# EAGLE schematic XMICRO BP8 (EAGLE 6.3)
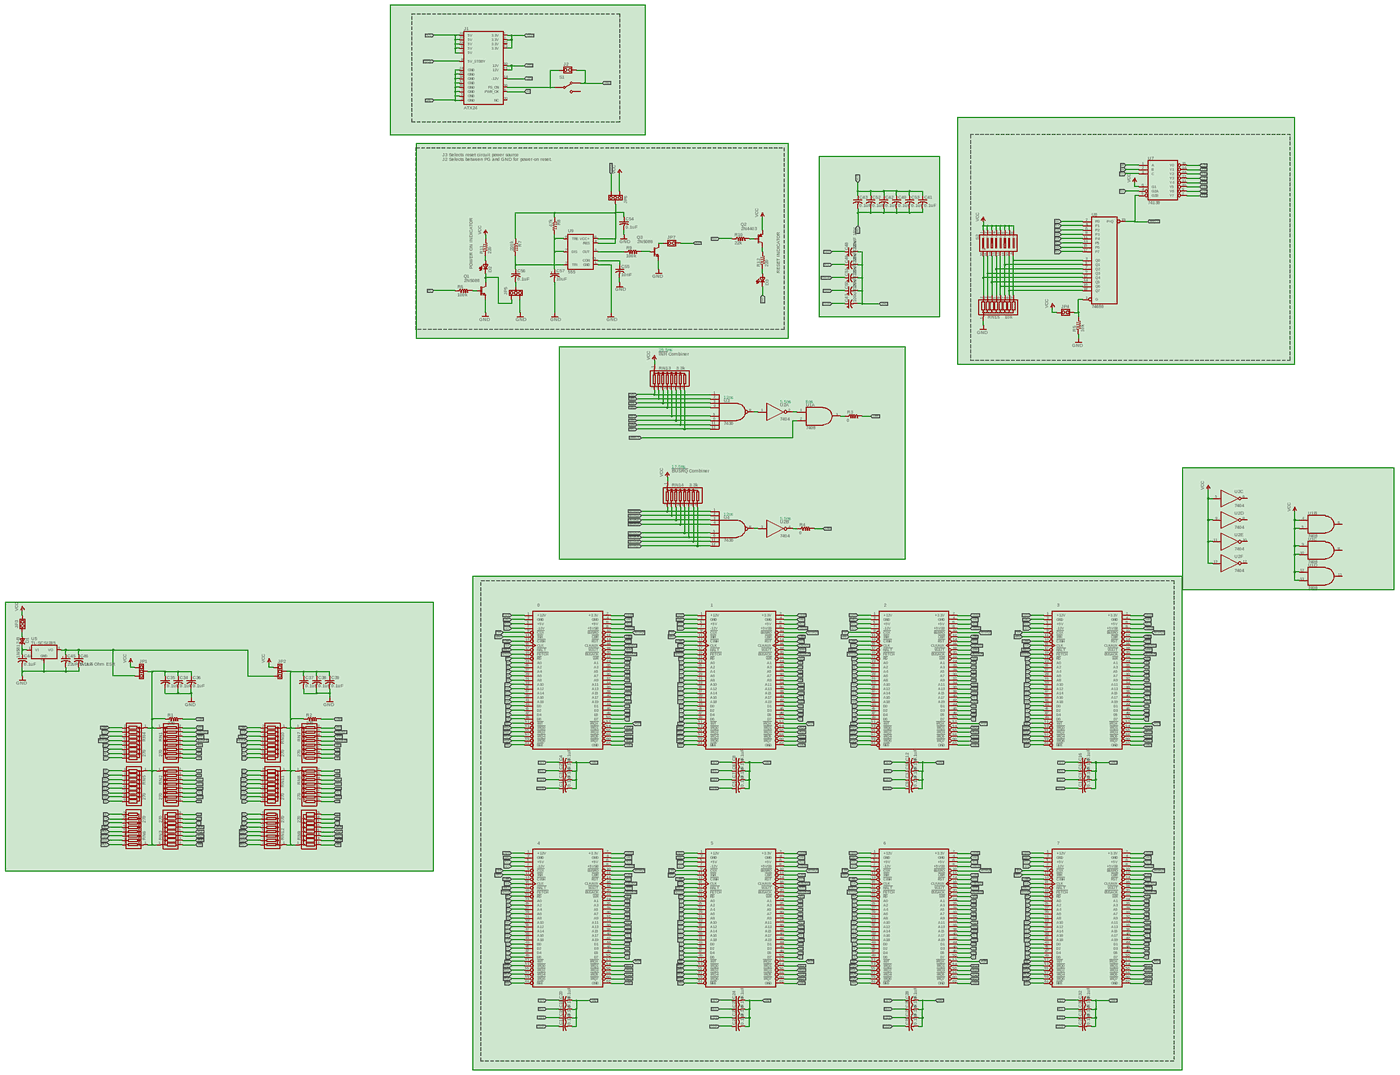
[diagram p0: schematic, sheet 1, overview]
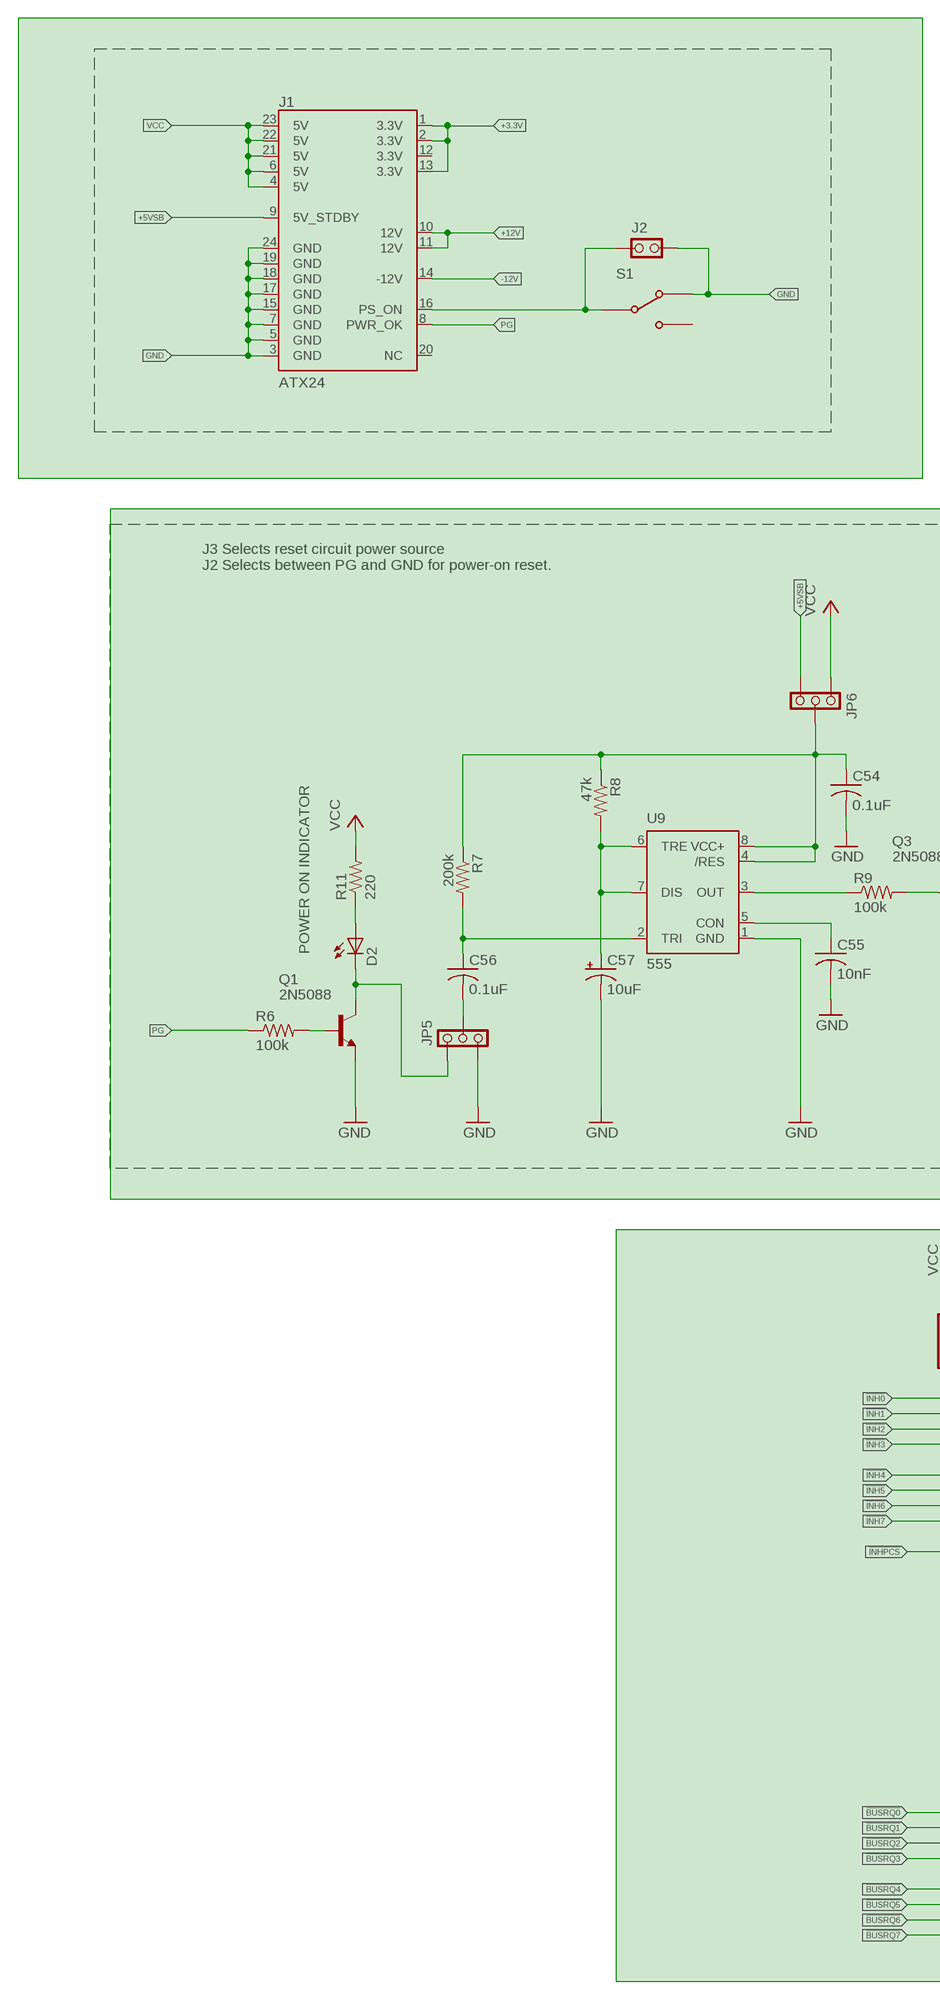
[diagram p1: schematic, sheet 1, part 1 of 4]
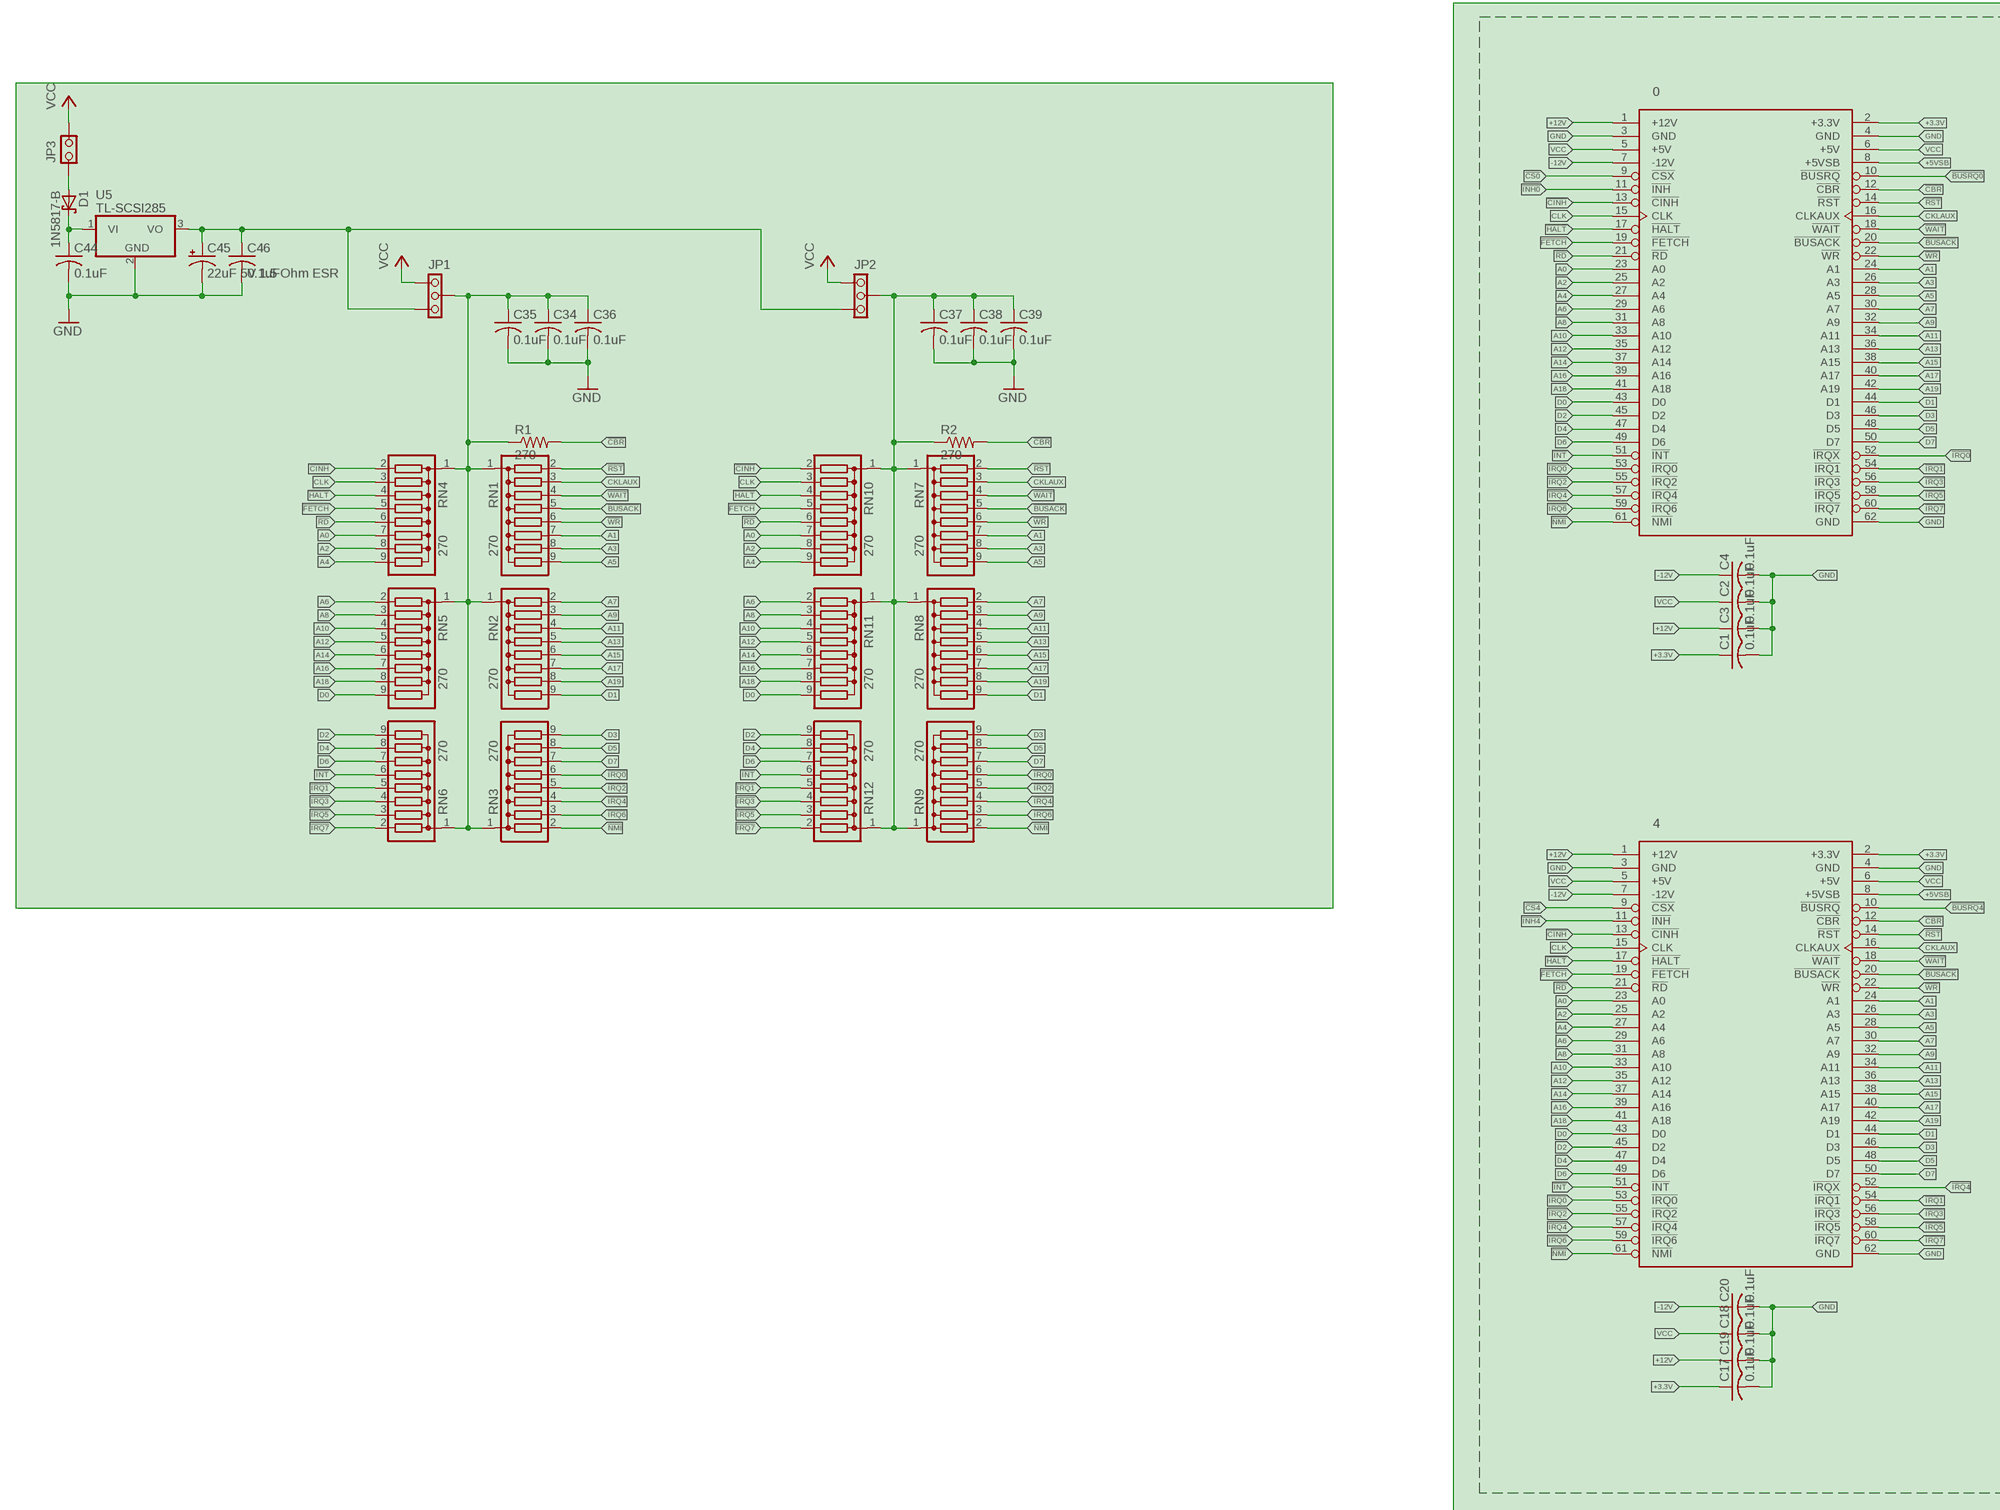
[diagram p2: schematic, sheet 1, part 2 of 4]
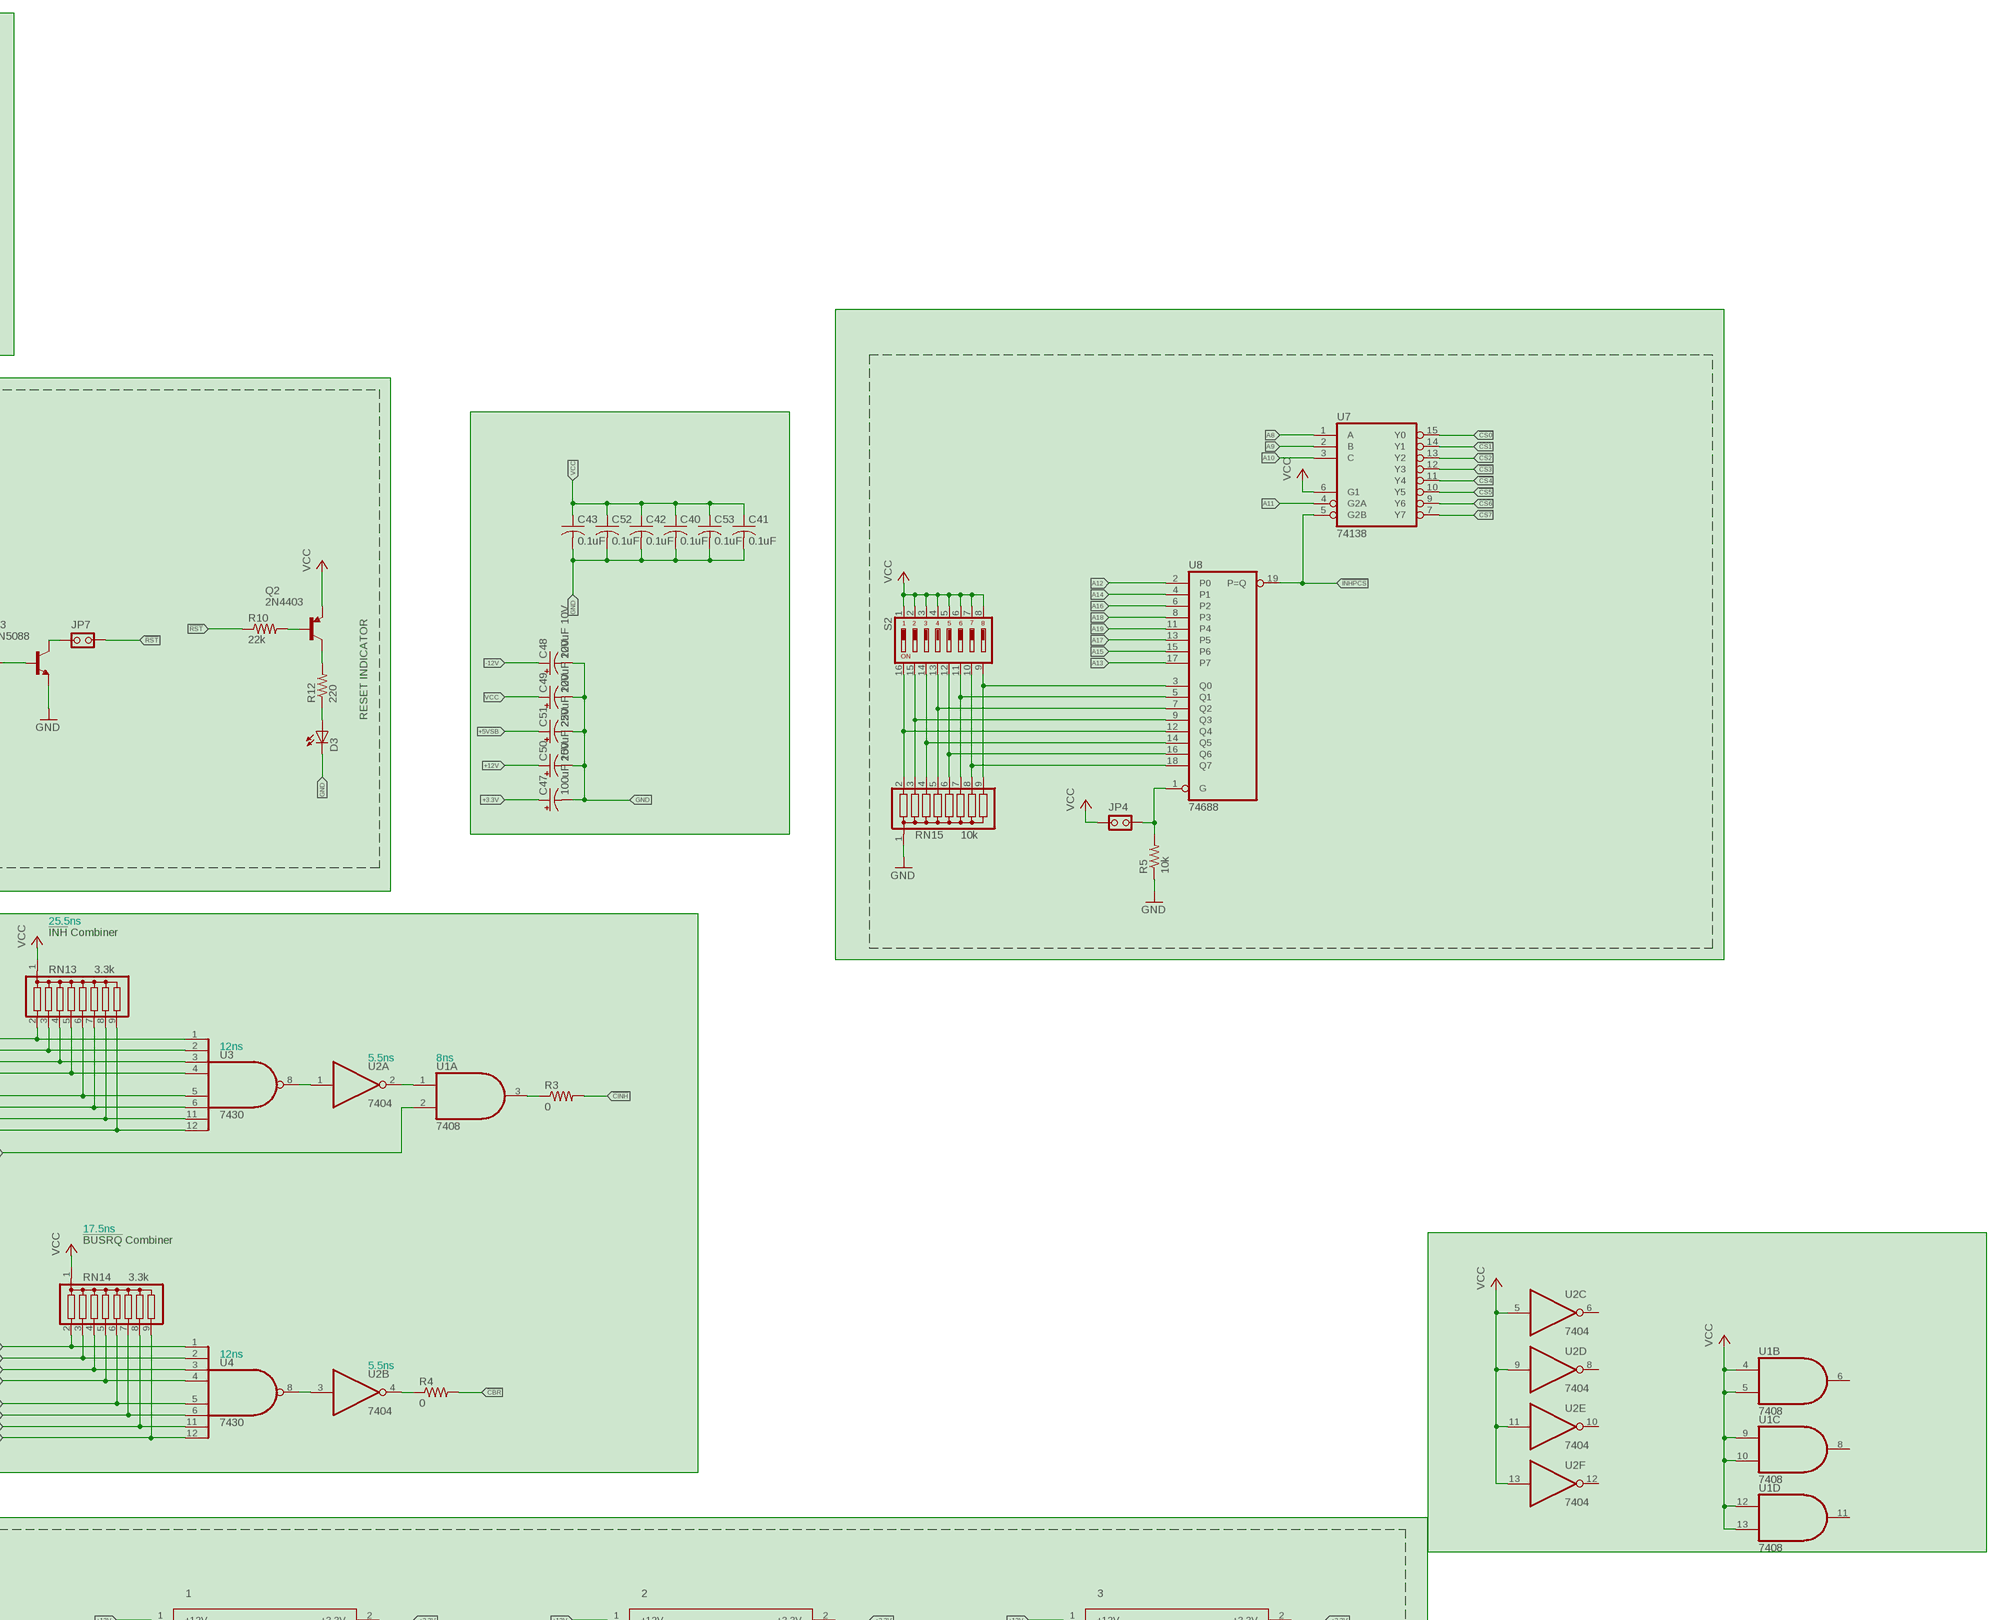
[diagram p3: schematic, sheet 1, part 3 of 4]
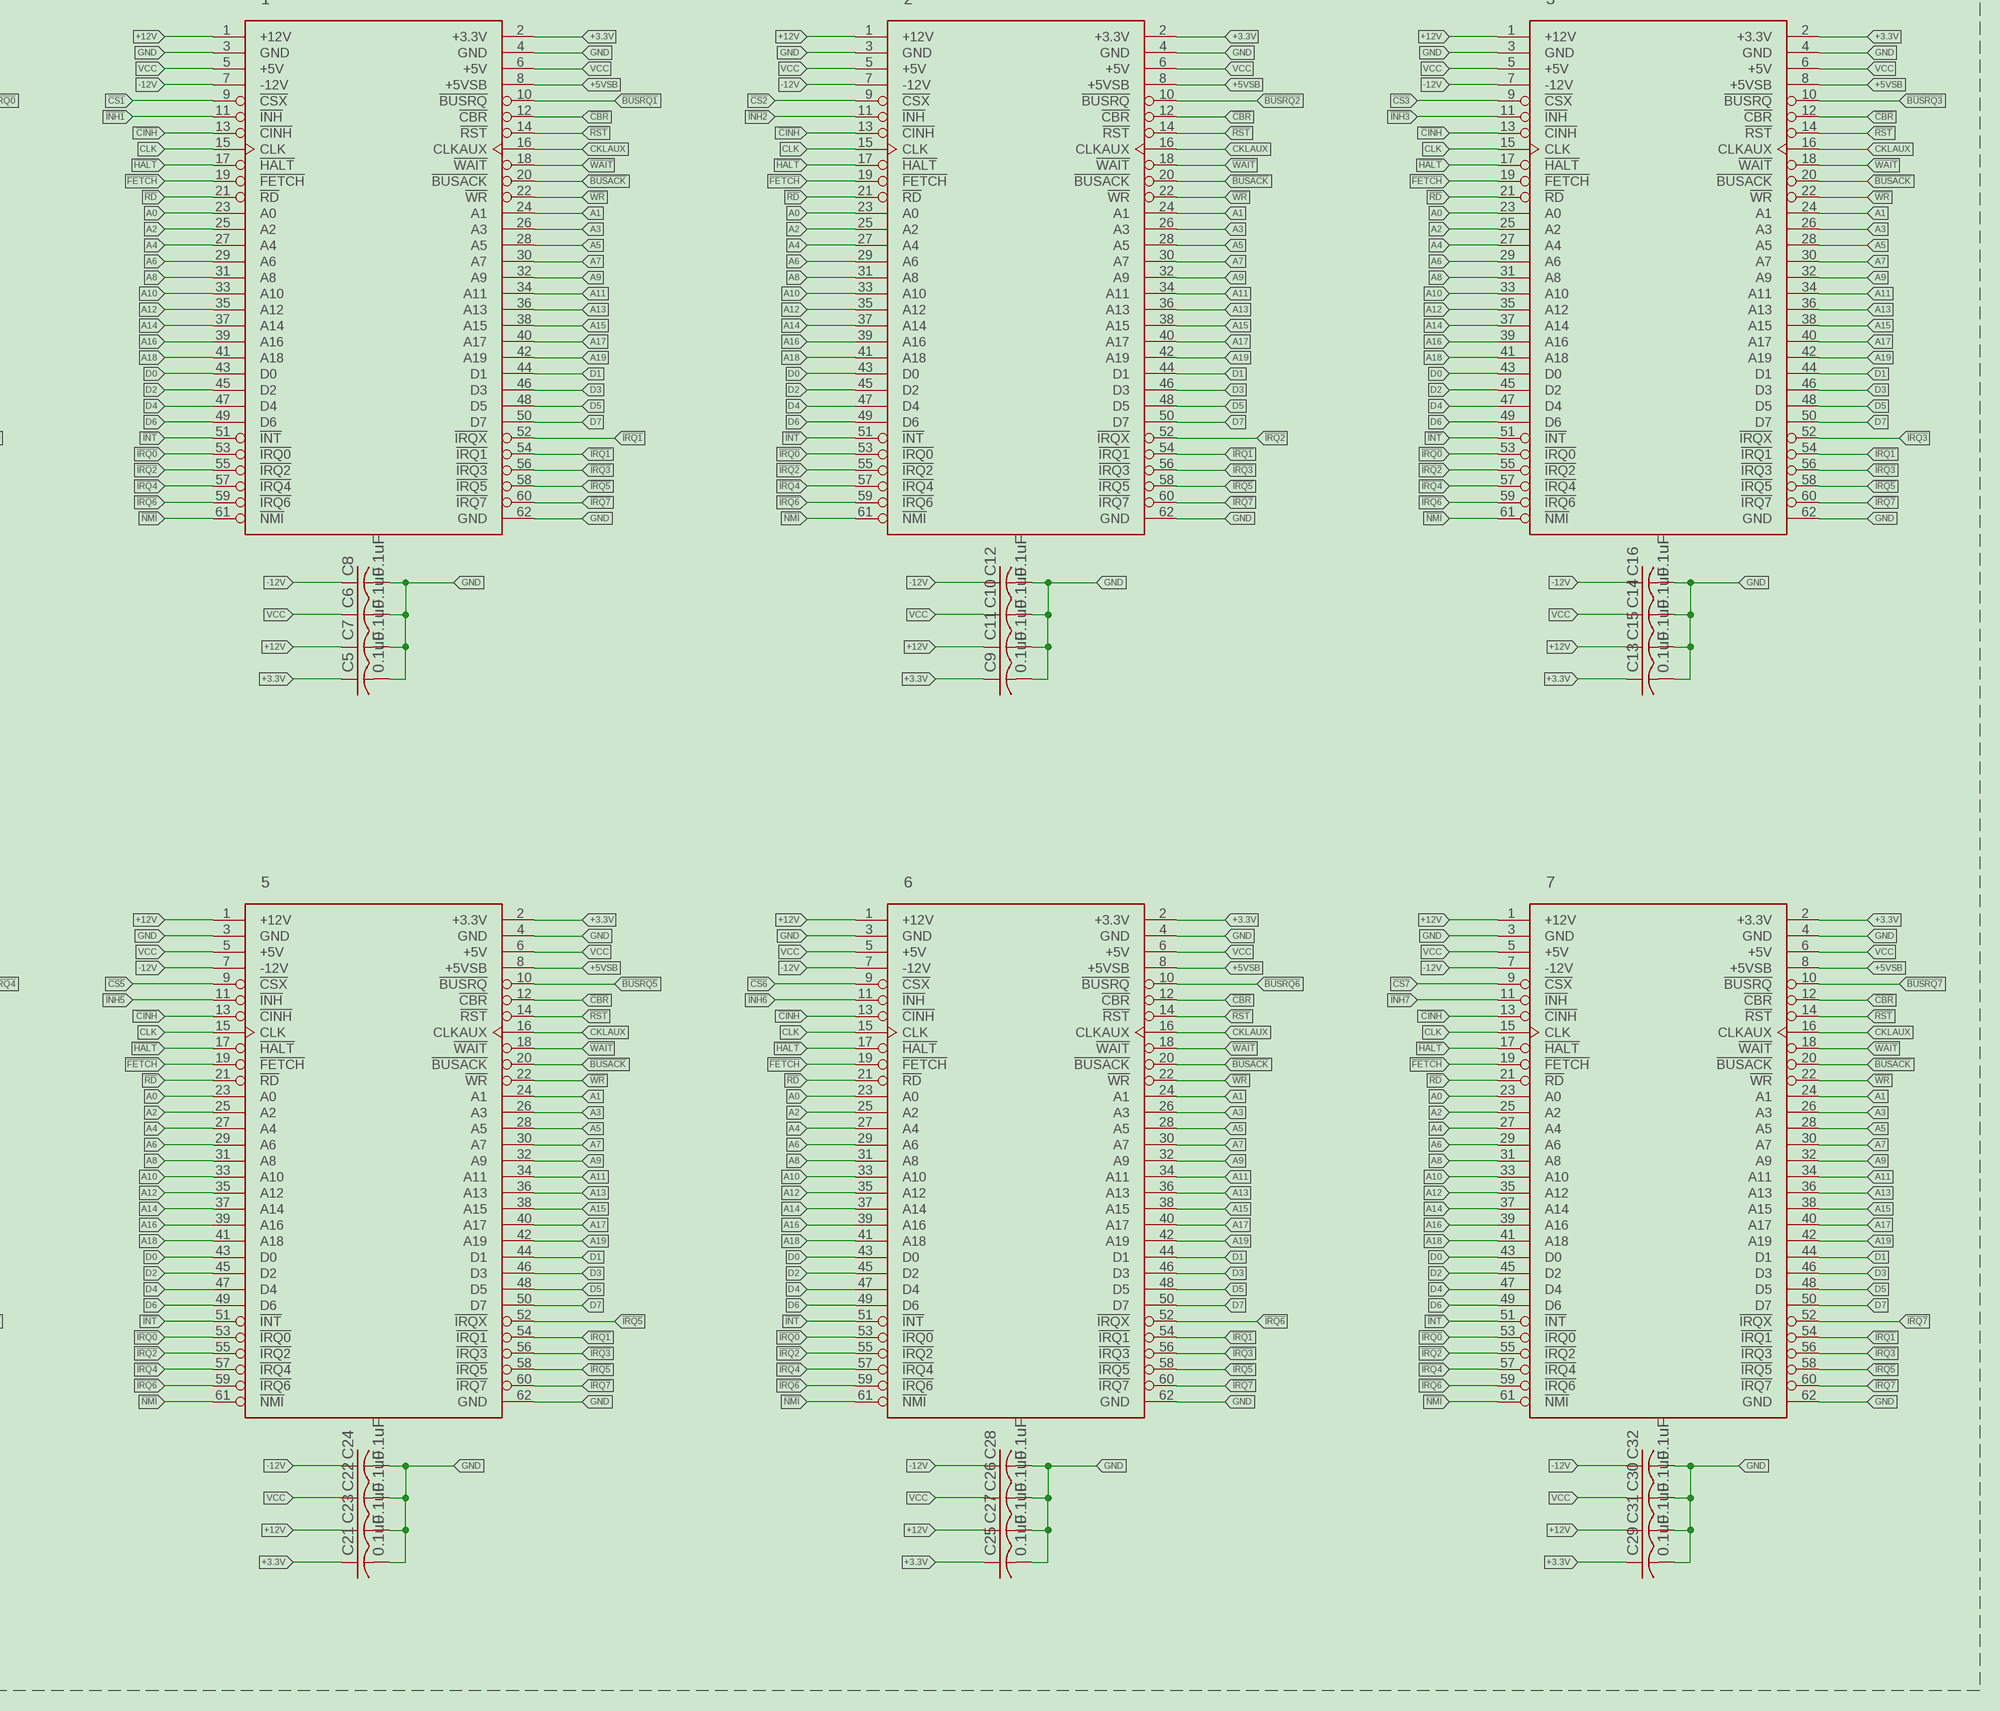
[diagram p4: schematic, sheet 1, part 4 of 4]

## Parts
0  XMICRO-BUS-PHYSICAL-EDGE62F  [EDGE62F]
1  XMICRO-BUS-PHYSICAL-EDGE62F  [EDGE62F]
2  XMICRO-BUS-PHYSICAL-EDGE62F  [EDGE62F]
3  XMICRO-BUS-PHYSICAL-EDGE62F  [EDGE62F]
4  XMICRO-BUS-PHYSICAL-EDGE62F  [EDGE62F]
5  XMICRO-BUS-PHYSICAL-EDGE62F  [EDGE62F]
6  XMICRO-BUS-PHYSICAL-EDGE62F  [EDGE62F]
7  XMICRO-BUS-PHYSICAL-EDGE62F  [EDGE62F]
C1  0.1uF  C-US025-024X044  [C025-024X044]
C2  0.1uF  C-US025-024X044  [C025-024X044]
C3  0.1uF  C-US025-024X044  [C025-024X044]
C4  0.1uF  C-US050-024X044  [C050-024X044]
C5  0.1uF  C-US025-024X044  [C025-024X044]
C6  0.1uF  C-US025-024X044  [C025-024X044]
C7  0.1uF  C-US025-024X044  [C025-024X044]
C8  0.1uF  C-US050-024X044  [C050-024X044]
C9  0.1uF  C-US025-024X044  [C025-024X044]
C10  0.1uF  C-US025-024X044  [C025-024X044]
C11  0.1uF  C-US025-024X044  [C025-024X044]
C12  0.1uF  C-US050-024X044  [C050-024X044]
C13  0.1uF  C-US025-024X044  [C025-024X044]
C14  0.1uF  C-US025-024X044  [C025-024X044]
C15  0.1uF  C-US025-024X044  [C025-024X044]
C16  0.1uF  C-US050-024X044  [C050-024X044]
C17  0.1uF  C-US025-024X044  [C025-024X044]
C18  0.1uF  C-US025-024X044  [C025-024X044]
C19  0.1uF  C-US025-024X044  [C025-024X044]
C20  0.1uF  C-US050-024X044  [C050-024X044]
C21  0.1uF  C-US025-024X044  [C025-024X044]
C22  0.1uF  C-US025-024X044  [C025-024X044]
C23  0.1uF  C-US025-024X044  [C025-024X044]
C24  0.1uF  C-US050-024X044  [C050-024X044]
C25  0.1uF  C-US025-024X044  [C025-024X044]
C26  0.1uF  C-US025-024X044  [C025-024X044]
C27  0.1uF  C-US025-024X044  [C025-024X044]
C28  0.1uF  C-US050-024X044  [C050-024X044]
C29  0.1uF  C-US025-024X044  [C025-024X044]
C30  0.1uF  C-US025-024X044  [C025-024X044]
C31  0.1uF  C-US025-024X044  [C025-024X044]
C32  0.1uF  C-US025-024X044  [C025-024X044]
C34  0.1uF  C-US025-024X044  [C025-024X044]
C35  0.1uF  C-US025-024X044  [C025-024X044]
C36  0.1uF  C-US025-024X044  [C025-024X044]
C37  0.1uF  C-US025-024X044  [C025-024X044]
C38  0.1uF  C-US025-024X044  [C025-024X044]
C39  0.1uF  C-US025-024X044  [C025-024X044]
C40  0.1uF  C-US025-024X044  [C025-024X044]
C41  0.1uF  C-US025-024X044  [C025-024X044]
C42  0.1uF  C-US025-024X044  [C025-024X044]
C43  0.1uF  C-US025-024X044  [C025-024X044]
C44  0.1uF  C-US025-024X044  [C025-024X044]
C45  22uF 5V 1.5 Ohm ESR  CPOL-USE2.5-7  [E2,5-7]
C46  0.1uF  C-US050-024X044  [C050-024X044]
C47  100uF 25V  CPOL-US-10-5  [C-10-5]
C48  220uF 10V  CPOL-US-10-5  [C-10-5]
C49  220uF 10V  CPOL-US-10-5  [C-10-5]
C50  100uF 25V  CPOL-US-10-5  [C-10-5]
C51  220uF 10V  CPOL-US-10-5  [C-10-5]
C52  0.1uF  C-US025-024X044  [C025-024X044]
C53  0.1uF  C-US025-024X044  [C025-024X044]
C54  0.1uF  C-US025-024X044  [C025-024X044]
C55  10nF  C-US025-024X044  [C025-024X044]
C56  0.1uF  C-US025-024X044  [C025-024X044]
C57  10uF  CPOL-USE2.5-7  [E2,5-7]
D1  1N5817-B  [DO41-7.6]
D2  LED5MM  [LED5MM]
D3  LED5MM  [LED5MM]
J1  ATX24  [ATX24]
J2  PINHD-1X2THRU  [1X02]
JP1  PINHD1X3THRU  [1X03]
JP2  PINHD1X3THRU  [1X03]
JP3  PINHD-1X2THRU  [1X02]
JP4  PINHD-1X2THRU  [1X02]
JP5  PINHD1X3THRU  [1X03]
JP6  PINHD1X3THRU  [1X03]
JP7  PINHD-1X2THRU  [1X02]
Q1  2N5088  TRANSISTOR-NPN-2N5088  [TO92]
Q2  2N4403  TRANSISTOR-PNP-2N4403  [TO92]
Q3  2N5088  TRANSISTOR-NPN-2N5088  [TO92]
R1  270  R-US_0207/10  [0207/10]
R2  270  R-US_0207/10  [0207/10]
R3  0  R-US_0207/10  [0207/10]
R4  0  R-US_0207/10  [0207/10]
R5  10k  R-US_0207/10  [0207/10]
R6  100k  R-US_0207/10  [0207/10]
R7  200k  R-US_0207/10  [0207/10]
R8  47k  R-US_0207/10  [0207/10]
R9  100k  R-US_0207/10  [0207/10]
R10  22k  R-US_0207/10  [0207/10]
R11  220  R-US_0207/10  [0207/10]
R12  220  R-US_0207/10  [0207/10]
RN1  270  G08R  [SIL9]
RN2  270  G08R  [SIL9]
RN3  270  G08R  [SIL9]
RN4  270  G08R  [SIL9]
RN5  270  G08R  [SIL9]
RN6  270  G08R  [SIL9]
RN7  270  G08R  [SIL9]
RN8  270  G08R  [SIL9]
RN9  270  G08R  [SIL9]
RN10  270  G08R  [SIL9]
RN11  270  G08R  [SIL9]
RN12  270  G08R  [SIL9]
RN13  3.3k  G08R  [SIL9]
RN14  3.3k  G08R  [SIL9]
RN15  10k  G08R  [SIL9]
S1  SPDTT411013  [T411013]
S2  SW-DIP08  [SW-DIP8]
U1  7408  74LS08N  [DIL14]
U2  7404  74LS04N  [DIL14]
U3  7430  74LS30N  [DIL14]
U4  7430  74LS30N  [DIL14]
U5  TL-SCSI285  TL-SCSI285-TO220H  [TO220H]
U7  74138  74LS138N  [DIL16]
U8  74688  74LS688N  [DIL20]
U9  555  NE555  [DIL-08]

## Nets
!BUSACK: 0.20(!BUSACK) 1.20(!BUSACK) 2.20(!BUSACK) 3.20(!BUSACK) 4.20(!BUSACK) 5.20(!BUSACK) 6.20(!BUSACK) 7.20(!BUSACK) RN1.5 RN7.5
!BUSRQ0: 0.10(!BUSRQ) RN14.2 U4.1(I0)
!BUSRQ1: 1.10(!BUSRQ) RN14.3 U4.2(I1)
!BUSRQ2: 2.10(!BUSRQ) RN14.4 U4.3(I2)
!BUSRQ3: 3.10(!BUSRQ) RN14.5 U4.4(I3)
!BUSRQ4: 4.10(!BUSRQ) RN14.6 U4.5(I4)
!BUSRQ5: 5.10(!BUSRQ) RN14.7 U4.6(I5)
!BUSRQ6: 6.10(!BUSRQ) RN14.8 U4.11(I6)
!BUSRQ7: 7.10(!BUSRQ) RN14.9 U4.12(I7)
!CBR: 0.12(!CBR) 1.12(!CBR) 2.12(!CBR) 3.12(!CBR) 4.12(!CBR) 5.12(!CBR) 6.12(!CBR) 7.12(!CBR) R1.2 R2.2 R4.2
!CINH: 0.13(!CINH) 1.13(!CINH) 2.13(!CINH) 3.13(!CINH) 4.13(!CINH) 5.13(!CINH) 6.13(!CINH) 7.13(!CINH) R3.2 RN4.2 RN10.2
!CS0: 0.9(!CSX) U7.15(Y0)
!CS1: 1.9(!CSX) U7.14(Y1)
!CS2: 2.9(!CSX) U7.13(Y2)
!CS3: 3.9(!CSX) U7.12(Y3)
!CS4: 4.9(!CSX) U7.11(Y4)
!CS5: 5.9(!CSX) U7.10(Y5)
!CS6: 6.9(!CSX) U7.9(Y6)
!CS7: 7.9(!CSX) U7.7(Y7)
!FETCH: 0.19(!FETCH) 1.19(!FETCH) 2.19(!FETCH) 3.19(!FETCH) 4.19(!FETCH) 5.19(!FETCH) 6.19(!FETCH) 7.19(!FETCH) RN4.5 RN10.5
!HALT: 0.17(!HALT) 1.17(!HALT) 2.17(!HALT) 3.17(!HALT) 4.17(!HALT) 5.17(!HALT) 6.17(!HALT) 7.17(!HALT) RN4.4 RN10.4
!INH0: 0.11(!INH) RN13.2 U3.1(I0)
!INH1: 1.11(!INH) RN13.3 U3.2(I1)
!INH2: 2.11(!INH) RN13.4 U3.3(I2)
!INH3: 3.11(!INH) RN13.5 U3.4(I3)
!INH4: 4.11(!INH) RN13.6 U3.5(I4)
!INH5: 5.11(!INH) RN13.7 U3.6(I5)
!INH6: 6.11(!INH) RN13.8 U3.11(I6)
!INH7: 7.11(!INH) RN13.9 U3.12(I7)
!INHPCS: U1.2(A:I1) U7.5(G2B) U8.19(P=Q)
!INT: 0.51(!INT) 1.51(!INT) 2.51(!INT) 3.51(!INT) 4.51(!INT) 5.51(!INT) 6.51(!INT) 7.51(!INT) RN6.6 RN12.6
!IRQ0: 0.52(!IRQX) 0.53(!IRQ0) 1.53(!IRQ0) 2.53(!IRQ0) 3.53(!IRQ0) 4.53(!IRQ0) 5.53(!IRQ0) 6.53(!IRQ0) 7.53(!IRQ0) RN3.6 RN9.6
!IRQ1: 0.54(!IRQ1) 1.52(!IRQX) 1.54(!IRQ1) 2.54(!IRQ1) 3.54(!IRQ1) 4.54(!IRQ1) 5.54(!IRQ1) 6.54(!IRQ1) 7.54(!IRQ1) RN6.5 RN12.5
!IRQ2: 0.55(!IRQ2) 1.55(!IRQ2) 2.52(!IRQX) 2.55(!IRQ2) 3.55(!IRQ2) 4.55(!IRQ2) 5.55(!IRQ2) 6.55(!IRQ2) 7.55(!IRQ2) RN3.5 RN9.5
!IRQ3: 0.56(!IRQ3) 1.56(!IRQ3) 2.56(!IRQ3) 3.52(!IRQX) 3.56(!IRQ3) 4.56(!IRQ3) 5.56(!IRQ3) 6.56(!IRQ3) 7.56(!IRQ3) RN6.4 RN12.4
!IRQ4: 0.57(!IRQ4) 1.57(!IRQ4) 2.57(!IRQ4) 3.57(!IRQ4) 4.52(!IRQX) 4.57(!IRQ4) 5.57(!IRQ4) 6.57(!IRQ4) 7.57(!IRQ4) RN3.4 RN9.4
!IRQ5: 0.58(!IRQ5) 1.58(!IRQ5) 2.58(!IRQ5) 3.58(!IRQ5) 4.58(!IRQ5) 5.52(!IRQX) 5.58(!IRQ5) 6.58(!IRQ5) 7.58(!IRQ5) RN6.3 RN12.3
!IRQ6: 0.59(!IRQ6) 1.59(!IRQ6) 2.59(!IRQ6) 3.59(!IRQ6) 4.59(!IRQ6) 5.59(!IRQ6) 6.52(!IRQX) 6.59(!IRQ6) 7.59(!IRQ6) RN3.3 RN9.3
!IRQ7: 0.60(!IRQ7) 1.60(!IRQ7) 2.60(!IRQ7) 3.60(!IRQ7) 4.60(!IRQ7) 5.60(!IRQ7) 6.60(!IRQ7) 7.52(!IRQX) 7.60(!IRQ7) RN6.2 RN12.2
!NMI: 0.61(!NMI) 1.61(!NMI) 2.61(!NMI) 3.61(!NMI) 4.61(!NMI) 5.61(!NMI) 6.61(!NMI) 7.61(!NMI) RN3.2 RN9.2
!RD: 0.21(!RD) 1.21(!RD) 2.21(!RD) 3.21(!RD) 4.21(!RD) 5.21(!RD) 6.21(!RD) 7.21(!RD) RN4.6 RN10.6
!RST: 0.14(!RST) 1.14(!RST) 2.14(!RST) 3.14(!RST) 4.14(!RST) 5.14(!RST) 6.14(!RST) 7.14(!RST) JP7.2 R10.1 RN1.2 RN7.2
!WAIT: 0.18(!WAIT) 1.18(!WAIT) 2.18(!WAIT) 3.18(!WAIT) 4.18(!WAIT) 5.18(!WAIT) 6.18(!WAIT) 7.18(!WAIT) RN1.4 RN7.4
!WR: 0.22(!WR) 1.22(!WR) 2.22(!WR) 3.22(!WR) 4.22(!WR) 5.22(!WR) 6.22(!WR) 7.22(!WR) RN1.6 RN7.6
+3.3V: 0.2(+3.3V) 1.2(+3.3V) 2.2(+3.3V) 3.2(+3.3V) 4.2(+3.3V) 5.2(+3.3V) 6.2(+3.3V) 7.2(+3.3V) C1.1 C5.1 C9.1 C13.1 C17.1 C21.1 C25.1 C29.1 C47.+ J1.1(3.3V) J1.2(3.3V) J1.13(3.3V)
+5VSB: 0.8(+5VSB) 1.8(+5VSB) 2.8(+5VSB) 3.8(+5VSB) 4.8(+5VSB) 5.8(+5VSB) 6.8(+5VSB) 7.8(+5VSB) C51.+ J1.9(5V_STDBY) JP6.3
+12V: 0.1(+12V) 1.1(+12V) 2.1(+12V) 3.1(+12V) 4.1(+12V) 5.1(+12V) 6.1(+12V) 7.1(+12V) C3.1 C7.1 C11.1 C15.1 C19.1 C23.1 C27.1 C31.1 C50.+ J1.10(12V) J1.11(12V)
-12V: 0.7(-12V) 1.7(-12V) 2.7(-12V) 3.7(-12V) 4.7(-12V) 5.7(-12V) 6.7(-12V) 7.7(-12V) C4.1 C8.1 C12.1 C16.1 C20.1 C24.1 C28.1 C32.1 C48.+ J1.14(-12V)
A0: 0.23(A0) 1.23(A0) 2.23(A0) 3.23(A0) 4.23(A0) 5.23(A0) 6.23(A0) 7.23(A0) RN4.7 RN10.7
A1: 0.24(A1) 1.24(A1) 2.24(A1) 3.24(A1) 4.24(A1) 5.24(A1) 6.24(A1) 7.24(A1) RN1.7 RN7.7
A2: 0.25(A2) 1.25(A2) 2.25(A2) 3.25(A2) 4.25(A2) 5.25(A2) 6.25(A2) 7.25(A2) RN4.8 RN10.8
A3: 0.26(A3) 1.26(A3) 2.26(A3) 3.26(A3) 4.26(A3) 5.26(A3) 6.26(A3) 7.26(A3) RN1.8 RN7.8
A4: 0.27(A4) 1.27(A4) 2.27(A4) 3.27(A4) 4.27(A4) 5.27(A4) 6.27(A4) 7.27(A4) RN4.9 RN10.9
A5: 0.28(A5) 1.28(A5) 2.28(A5) 3.28(A5) 4.28(A5) 5.28(A5) 6.28(A5) 7.28(A5) RN1.9 RN7.9
A6: 0.29(A6) 1.29(A6) 2.29(A6) 3.29(A6) 4.29(A6) 5.29(A6) 6.29(A6) 7.29(A6) RN5.2 RN11.2
A7: 0.30(A7) 1.30(A7) 2.30(A7) 3.30(A7) 4.30(A7) 5.30(A7) 6.30(A7) 7.30(A7) RN2.2 RN8.2
A8: 0.31(A8) 1.31(A8) 2.31(A8) 3.31(A8) 4.31(A8) 5.31(A8) 6.31(A8) 7.31(A8) RN5.3 RN11.3 U7.1(A)
A9: 0.32(A9) 1.32(A9) 2.32(A9) 3.32(A9) 4.32(A9) 5.32(A9) 6.32(A9) 7.32(A9) RN2.3 RN8.3 U7.2(B)
A10: 0.33(A10) 1.33(A10) 2.33(A10) 3.33(A10) 4.33(A10) 5.33(A10) 6.33(A10) 7.33(A10) RN5.4 RN11.4 U7.3(C)
A11: 0.34(A11) 1.34(A11) 2.34(A11) 3.34(A11) 4.34(A11) 5.34(A11) 6.34(A11) 7.34(A11) RN2.4 RN8.4 U7.4(G2A)
A12: 0.35(A12) 1.35(A12) 2.35(A12) 3.35(A12) 4.35(A12) 5.35(A12) 6.35(A12) 7.35(A12) RN5.5 RN11.5 U8.2(P0)
A13: 0.36(A13) 1.36(A13) 2.36(A13) 3.36(A13) 4.36(A13) 5.36(A13) 6.36(A13) 7.36(A13) RN2.5 RN8.5 U8.17(P7)
A14: 0.37(A14) 1.37(A14) 2.37(A14) 3.37(A14) 4.37(A14) 5.37(A14) 6.37(A14) 7.37(A14) RN5.6 RN11.6 U8.4(P1)
A15: 0.38(A15) 1.38(A15) 2.38(A15) 3.38(A15) 4.38(A15) 5.38(A15) 6.38(A15) 7.38(A15) RN2.6 RN8.6 U8.15(P6)
A16: 0.39(A16) 1.39(A16) 2.39(A16) 3.39(A16) 4.39(A16) 5.39(A16) 6.39(A16) 7.39(A16) RN5.7 RN11.7 U8.6(P2)
A17: 0.40(A17) 1.40(A17) 2.40(A17) 3.40(A17) 4.40(A17) 5.40(A17) 6.40(A17) 7.40(A17) RN2.7 RN8.7 U8.13(P5)
A18: 0.41(A18) 1.41(A18) 2.41(A18) 3.41(A18) 4.41(A18) 5.41(A18) 6.41(A18) 7.41(A18) RN5.8 RN11.8 U8.8(P3)
A19: 0.42(A19) 1.42(A19) 2.42(A19) 3.42(A19) 4.42(A19) 5.42(A19) 6.42(A19) 7.42(A19) RN2.8 RN8.8 U8.11(P4)
CKLAUX: 0.16(CLKAUX) 1.16(CLKAUX) 2.16(CLKAUX) 3.16(CLKAUX) 4.16(CLKAUX) 5.16(CLKAUX) 6.16(CLKAUX) 7.16(CLKAUX) RN1.3 RN7.3
CLK: 0.15(CLK) 1.15(CLK) 2.15(CLK) 3.15(CLK) 4.15(CLK) 5.15(CLK) 6.15(CLK) 7.15(CLK) RN4.3 RN10.3
D0: 0.43(D0) 1.43(D0) 2.43(D0) 3.43(D0) 4.43(D0) 5.43(D0) 6.43(D0) 7.43(D0) RN5.9 RN11.9
D1: 0.44(D1) 1.44(D1) 2.44(D1) 3.44(D1) 4.44(D1) 5.44(D1) 6.44(D1) 7.44(D1) RN2.9 RN8.9
D2: 0.45(D2) 1.45(D2) 2.45(D2) 3.45(D2) 4.45(D2) 5.45(D2) 6.45(D2) 7.45(D2) RN6.9 RN12.9
D3: 0.46(D3) 1.46(D3) 2.46(D3) 3.46(D3) 4.46(D3) 5.46(D3) 6.46(D3) 7.46(D3) RN3.9 RN9.9
D4: 0.47(D4) 1.47(D4) 2.47(D4) 3.47(D4) 4.47(D4) 5.47(D4) 6.47(D4) 7.47(D4) RN6.8 RN12.8
D5: 0.48(D5) 1.48(D5) 2.48(D5) 3.48(D5) 4.48(D5) 5.48(D5) 6.48(D5) 7.48(D5) RN3.8 RN9.8
D6: 0.49(D6) 1.49(D6) 2.49(D6) 3.49(D6) 4.49(D6) 5.49(D6) 6.49(D6) 7.49(D6) RN6.7 RN12.7
D7: 0.50(D7) 1.50(D7) 2.50(D7) 3.50(D7) 4.50(D7) 5.50(D7) 6.50(D7) 7.50(D7) RN3.7 RN9.7
GND [GND]: 0.3(GND) 0.4(GND) 0.62(GND) 1.3(GND) 1.4(GND) 1.62(GND) 2.3(GND) 2.4(GND) 2.62(GND) 3.3(GND) 3.4(GND) 3.62(GND) 4.3(GND) 4.4(GND) 4.62(GND) 5.3(GND) 5.4(GND) 5.62(GND) 6.3(GND) 6.4(GND) 6.62(GND) 7.3(GND) 7.4(GND) 7.62(GND) C1.2 C2.2 C3.2 C4.2 C5.2 C6.2 C7.2 C8.2 C9.2 C10.2 C11.2 C12.2 C13.2 C14.2 C15.2 C16.2 C17.2 C18.2 C19.2 C20.2 C21.2 C22.2 C23.2 C24.2 C25.2 C26.2 C27.2 C28.2 C29.2 C30.2 C31.2 C32.2 C34.2 C35.2 C36.2 C37.2 C38.2 C39.2 C40.2 C41.2 C42.2 C43.2 C44.2 C45.- C46.2 C47.- C48.- C49.- C50.- C51.- C52.2 C53.2 C54.2 C55.2 C57.- D3.K(C) J1.3(GND) J1.5(GND) J1.7(GND) J1.15(GND) J1.17(GND) J1.18(GND) J1.19(GND) J1.24(GND) J2.2 JP5.3 Q1.1(E) Q3.1(E) R5.1 RN15.1 S1.P$1 U5.2(GND) U9.1(GND)
N$1: D2.K(C) JP5.1 Q1.3(C)
N$2: Q2.3(C) R12.2
N$3: Q2.2(B) R10.2
N$4: R9.1 U9.3(OUT)
N$5: JP7.1 Q3.3(C)
N$6: D3.A R12.1
N$7: C45.+ C46.1 JP1.3 JP2.3 U5.3(VO)
N$8: U2.1(A:I) U3.8(O)
N$9: U1.1(A:I0) U2.2(A:O)
N$10: U2.3(B:I) U4.8(O)
N$11: RN15.2 S2.16 U8.12(Q4)
N$12: RN15.3 S2.15 U8.9(Q3)
N$13: RN15.4 S2.14 U8.14(Q5)
N$14: RN15.5 S2.13 U8.7(Q2)
N$17: RN15.6 S2.12 U8.16(Q6)
N$18: RN15.7 S2.11 U8.5(Q1)
N$19: J1.16(PS_ON) J2.1 S1.P$2
N$21: R4.1 U2.4(B:O)
N$22: Q1.2(B) R6.2
N$23: D1.A JP3.1
N$24: D2.A R11.1
N$25: C55.1 U9.5(CON)
N$26: C44.1 D1.C U5.1(VI)
N$27: C37.1 C38.1 C39.1 JP2.2 R2.1 RN7.1 RN8.1 RN9.1 RN10.1 RN11.1 RN12.1
N$28: C34.1 C35.1 C36.1 JP1.2 R1.1 RN1.1 RN2.1 RN3.1 RN4.1 RN5.1 RN6.1
N$29: R3.1 U1.3(A:O)
N$30: RN15.8 S2.10 U8.18(Q7)
N$35: RN15.9 S2.9 U8.3(Q0)
N$36: JP4.2 R5.2 U8.1(G)
N$38: C54.1 JP6.2 R7.1 R8.1 U9.4(/RES) U9.8(VCC+)
N$39: C56.2 JP5.2
N$46: Q3.2(B) R9.2
N$75: C56.1 R7.2 U9.2(TRI)
N$76: C57.+ R8.2 U9.6(TRE) U9.7(DIS)
PG: J1.8(PWR_OK) R6.1
VCC: 0.5(+5V) 0.6(+5V) 1.5(+5V) 1.6(+5V) 2.5(+5V) 2.6(+5V) 3.5(+5V) 3.6(+5V) 4.5(+5V) 4.6(+5V) 5.5(+5V) 5.6(+5V) 6.5(+5V) 6.6(+5V) 7.5(+5V) 7.6(+5V) C2.1 C6.1 C10.1 C14.1 C18.1 C22.1 C26.1 C30.1 C40.1 C41.1 C42.1 C43.1 C49.+ C52.1 C53.1 J1.4(5V) J1.6(5V) J1.21(5V) J1.22(5V) J1.23(5V) JP1.1 JP2.1 JP3.2 JP4.1 JP6.1 Q2.1(E) R11.2 RN13.1 RN14.1 S2.1 S2.2 S2.3 S2.4 S2.5 S2.6 S2.7 S2.8 U1.4(B:I0) U1.5(B:I1) U1.9(C:I0) U1.10(C:I1) U1.12(D:I0) U1.13(D:I1) U2.5(C:I) U2.9(D:I) U2.11(E:I) U2.13(F:I) U7.6(G1)
Unconnected: J1.12(3.3V) J1.20(NC) S1.P$3 U1.6(B:O) U1.8(C:O) U1.11(D:O) U2.6(C:O) U2.8(D:O) U2.10(E:O) U2.12(F:O)

## Notes on the sheet
- J3 Selects reset circuit power source
  J2 Selects between PG and GND for power-on reset.
- 35-55 | 20-40
- 14
- POWER ON INDICATOR
- RESET INDICATOR
- 12 | 8 | 13
- 11
- 25.5ns
- !INH! Combiner
- 12ns
- 5.5ns | 8ns
- 12 | 8
- 11
- 17.5ns
- !BUSRQ! Combiner
- 12ns
- 5.5ns
- 12 | 8

## Power pins joined to a net without a drawn wire
GND: S1.P$4(GND) U1.7(P:GND) U2.7(P:GND) U3.7(GND) U4.7(GND) U7.8(GND) U8.10(GND)
VCC: U1.14(P:VCC) U2.14(P:VCC) U3.14(VCC) U4.14(VCC) U7.16(VCC) U8.20(VCC)

## Library data of the parts
0 1-7 = Custom:XMICRO-BUS-PHYSICAL
C1-C32 C34-C44 C46 C52-C56 = resistor:C-US: CAPACITOR, American symbol
C45 C57 = rcl:CPOL-US: POLARIZED CAPACITOR, American symbol
C47-C51 = Custom:CPOL-US
D1 = diode:1N581*: 1.0A SCHOTTKY BARRIER RECTIFIER Source: http://www.diodes.com/datasheets/ds23001.pdf
D2 D3 = led:LED: LED OSRAM: - CHIPLED LG R971, LG N971, LY N971, LG Q971, LY Q971, LO R971, LY R971 LH N974, LH R974 LS Q976, LO Q976, LY Q976 LO Q996 - Hyper CHIPLED LW Q18S LB Q993, LB Q99A, LB R99A - SideLED LS A670, LO A670, LY A670, LG A670, LP A670 LB A673, LV A673, LT A673, LW A673 LH A674 LY A675 LS A676, LA A676, LO A676, LY A676, LW A676 LS A679, LY A679, LG A679 - Hyper Micro SIDELED® LS Y876, LA Y876, LO Y876, LY Y876 LT Y87S - SmartLED LW L88C, LW L88S LB L89C, LB L89S, LG L890 LS L89K, LO L89K, LY L89K LS L896, LA L896, LO L896, LY L896 - TOPLED LS T670, LO T670, LY T670, LG T670, LP T670 LSG T670, LSP T670, LSY T670, LOP T670, LYG T670 LG T671, LOG T671, LSG T671 LB T673, LV T673, LT T673, LW T673 LH T674 LS T676, LA T676, LO T676, LY T676, LB T676, LH T676, LSB T676, LW T676 LB T67C, LV T67C, LT T67C, LS T67K, LO T67K, LY T67K, LW E67C LS E67B, LA E67B, LO E67B, LY E67B, LB E67C, LV E67C, LT E67C LW T67C LS T679, LY T679, LG T679 LS T770, LO T770, LY T770, LG T770, LP T770 LB T773, LV T773, LT T773, LW T773 LH T774 LS E675, LA E675, LY E675, LS T675 LS T776, LA T776, LO T776, LY T776, LB T776 LHGB T686 LT T68C, LB T68C - Hyper Mini TOPLED® LB M676 - Mini TOPLED Santana® LG M470 LS M47K, LO M47K, LY M47K Source: http://www.osram.convergy.de LUXEON: - LUMILED® LXK2-PW12-R00, LXK2-PW12-S00, LXK2-PW14-U00, LXK2-PW14-V00 LXK2-PM12-R00, LXK2-PM12-S00, LXK2-PM14-U00 LXK2-PE12-Q00, LXK2-PE12-R00, LXK2-PE12-S00, LXK2-PE14-T00, LXK2-PE14-U00 LXK2-PB12-K00, LXK2-PB12-L00, LXK2-PB12-M00, LXK2-PB14-N00, LXK2-PB14-P00, LXK2-PB14-Q00 LXK2-PR12-L00, LXK2-PR12-M00, LXK2-PR14-Q00, LXK2-PR14-R00 LXK2-PD12-Q00, LXK2-PD12-R00, LXK2-PD12-S00 LXK2-PH12-R00, LXK2-PH12-S00 LXK2-PL12-P00, LXK2-PL12-Q00, LXK2-PL12-R00 Source: www.luxeon.com KINGBRIGHT: KA-3528ASYC Source: www.kingbright.com
J1 = Custom:ATX24
J2 JP3 JP4 JP7 = Custom:PINHD-1X2THRU
JP1 JP2 JP5 JP6 = Custom:PINHD1X3THRU
Q1 Q3 = Custom:TRANSISTOR-NPN
Q2 = Custom:TRANSISTOR-PNP
R1-R12 = resistor:R-US_: RESISTOR, American symbol
RN1-RN15 = resistor-sil:G08R: SIL RESISTOR; OC_FARNELL: unknown; OC_NEWARK: unknown
S1 = Custom:SPDT
S2 = Custom:SW-DIP08
U1 = 74xx-us:74*08: Quad 2-input AND gate
U2 = 74xx-us:74*04: Hex INVERTER
U3 U4 = 74xx-us:74*30: 8-input NAND gate
U5 = Custom:TL-SCSI285
U7 = 74xx-us:74*138: 3-line to 8-line DECODER/DEMULTIPLEXER
U8 = 74xx-us:74*688: 8-bit MAGNITUDE/IDENTITY COMPARATOR, totem pole
U9 = st-microelectronics:NE555: General purpose bipolar Timer; MF: Arrow Electronics; MPN: NE555N; OC_FARNELL: 1467742; OC_NEWARK: 89K1486

## Net classes
1 GND: width 0.254 mm, clearance 0.381 mm